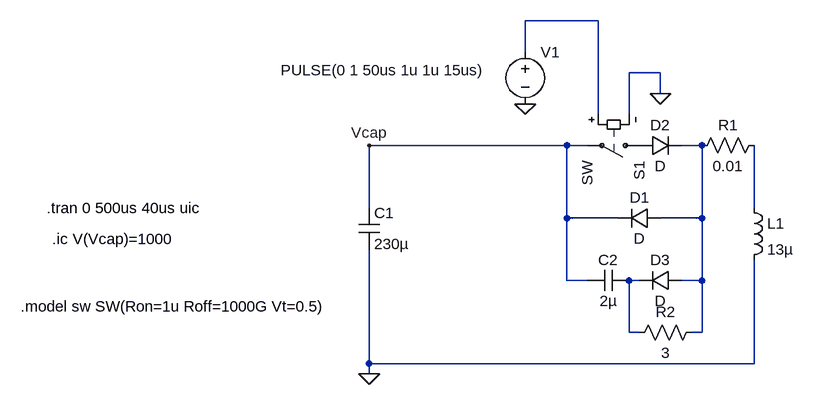
[diagram p0: schematic discharge.asc]
discharge.asc, the LTspice schematic file:
Version 4
SHEET 1 1380 680
WIRE 336 -208 224 -208
WIRE 224 -160 224 -208
WIRE 432 -128 384 -128
WIRE 432 -96 432 -128
WIRE 336 -64 336 -208
WIRE 384 -64 384 -128
WIRE 288 -16 -16 -16
WIRE 320 -16 288 -16
WIRE 496 -16 464 -16
WIRE -16 80 -16 -16
WIRE 576 80 576 -16
WIRE 288 96 288 -16
WIRE 368 96 288 96
WIRE 496 96 496 -16
WIRE 496 96 432 96
WIRE 288 192 288 96
WIRE 320 192 288 192
WIRE 400 192 384 192
WIRE 496 192 496 96
WIRE 496 192 464 192
WIRE 384 272 384 192
WIRE 400 272 384 272
WIRE 496 272 496 192
WIRE 496 272 480 272
WIRE -16 320 -16 144
WIRE 576 320 576 160
WIRE 576 320 -16 320
WIRE -16 336 -16 320
FLAG -16 -16 Vcap
FLAG -16 336 0
FLAG 224 -80 0
FLAG 432 -96 0
SYMBOL res 592 -32 R90
WINDOW 0 0 56 VBottom 2
WINDOW 3 32 56 VTop 2
SYMATTR InstName R1
SYMATTR Value 0.01
SYMBOL ind 560 64 R0
SYMATTR InstName L1
SYMATTR Value 13µ
SYMATTR SpiceLine Rser=0
SYMBOL diode 400 0 R270
WINDOW 0 32 32 VTop 2
WINDOW 3 0 32 VBottom 2
SYMATTR InstName D2
SYMBOL cap 384 176 R90
WINDOW 0 0 32 VBottom 2
WINDOW 3 32 32 VTop 2
SYMATTR InstName C2
SYMATTR Value 2µ
SYMBOL voltage 224 -176 R0
WINDOW 3 -376 44 Left 2
WINDOW 123 0 0 Left 0
WINDOW 39 0 0 Left 0
SYMATTR Value PULSE(0 1 50us 1u 1u 15us)
SYMATTR InstName V1
SYMBOL cap -32 80 R0
SYMATTR InstName C1
SYMATTR Value 230µ
SYMBOL sw 416 -16 R90
SYMATTR InstName S1
SYMBOL diode 432 80 R90
WINDOW 0 0 32 VBottom 2
WINDOW 3 32 32 VTop 2
SYMATTR InstName D1
SYMBOL diode 464 176 R90
WINDOW 0 0 32 VBottom 2
WINDOW 3 32 32 VTop 2
SYMATTR InstName D3
SYMBOL res 496 256 R90
WINDOW 0 0 56 VBottom 2
WINDOW 3 32 56 VTop 2
SYMATTR InstName R2
SYMATTR Value 3
TEXT -512 80 Left 2 !.tran 0 500us 40us uic
TEXT -504 128 Left 2 !.ic V(Vcap)=1000
TEXT -552 232 Left 2 !.model sw SW(Ron=1u Roff=1000G Vt=0.5)

The netlist it stands for:
* discharge.asc
R1 N003 N002 0.01
L1 N003 0 13µ Rser=0
D2 P001 N002 D
C2 N004 Vcap 2µ
V1 N001 0 PULSE(0 1 50us 1u 1u 15us)
C1 Vcap 0 230µ
S1 P001 Vcap N001 0 SW
D1 N002 Vcap D
D3 N002 N004 D
R2 N002 N004 3
.model D D
.lib standard.dio
.tran 0 500us 40us uic
.ic V(Vcap)=1000
.model sw SW(Ron=1u Roff=1000G Vt=0.5)
.backanno
.end